# Altium schematic sheet HDMI8x8_HSSwitchSet.SchDoc
size 431 x 279 mm; Date: Not shown in title block; ApprovedBy: Not shown in title block; CheckedBy: Not shown in title block; Author: Not shown in title block; CompanyName: Not shown in title block; Engineer: Not shown in title block; Organization: Not shown in title block; Address1: Not shown in title block; Address2: Not shown in title block; Address3: Not shown in title block; Address4: Not shown in title block; DocumentNumber: 1; Revision: Use project parameter SCH_Rev; SheetNumber: 2; SheetTotal: 3; PageSetup: Record=PageOptions|CenterHorizontal=True|CenterVertical=True|PrintScale=1.00|XCorrection=1.00|YCorrection=1.00|PrintKind=0|BorderSize=5000000|LeftOffset=0|BottomOffset=0|Orientation=2|PaperLength=1000|PaperWidth=1000|Scale=100|PaperSource=15|PrintQuality=600|MediaType=1|DitherType=10|PaperKind=Letter|PrintScaleMode=1; CurrentTime: Not shown in title block; CurrentDate: Not shown in title block; Time: Not shown in title block; DocumentFullPathAndName: Not shown in title block; DocumentName: Not shown in title block; ModifiedDate: Not shown in title block; ImagePath: Not shown in title block
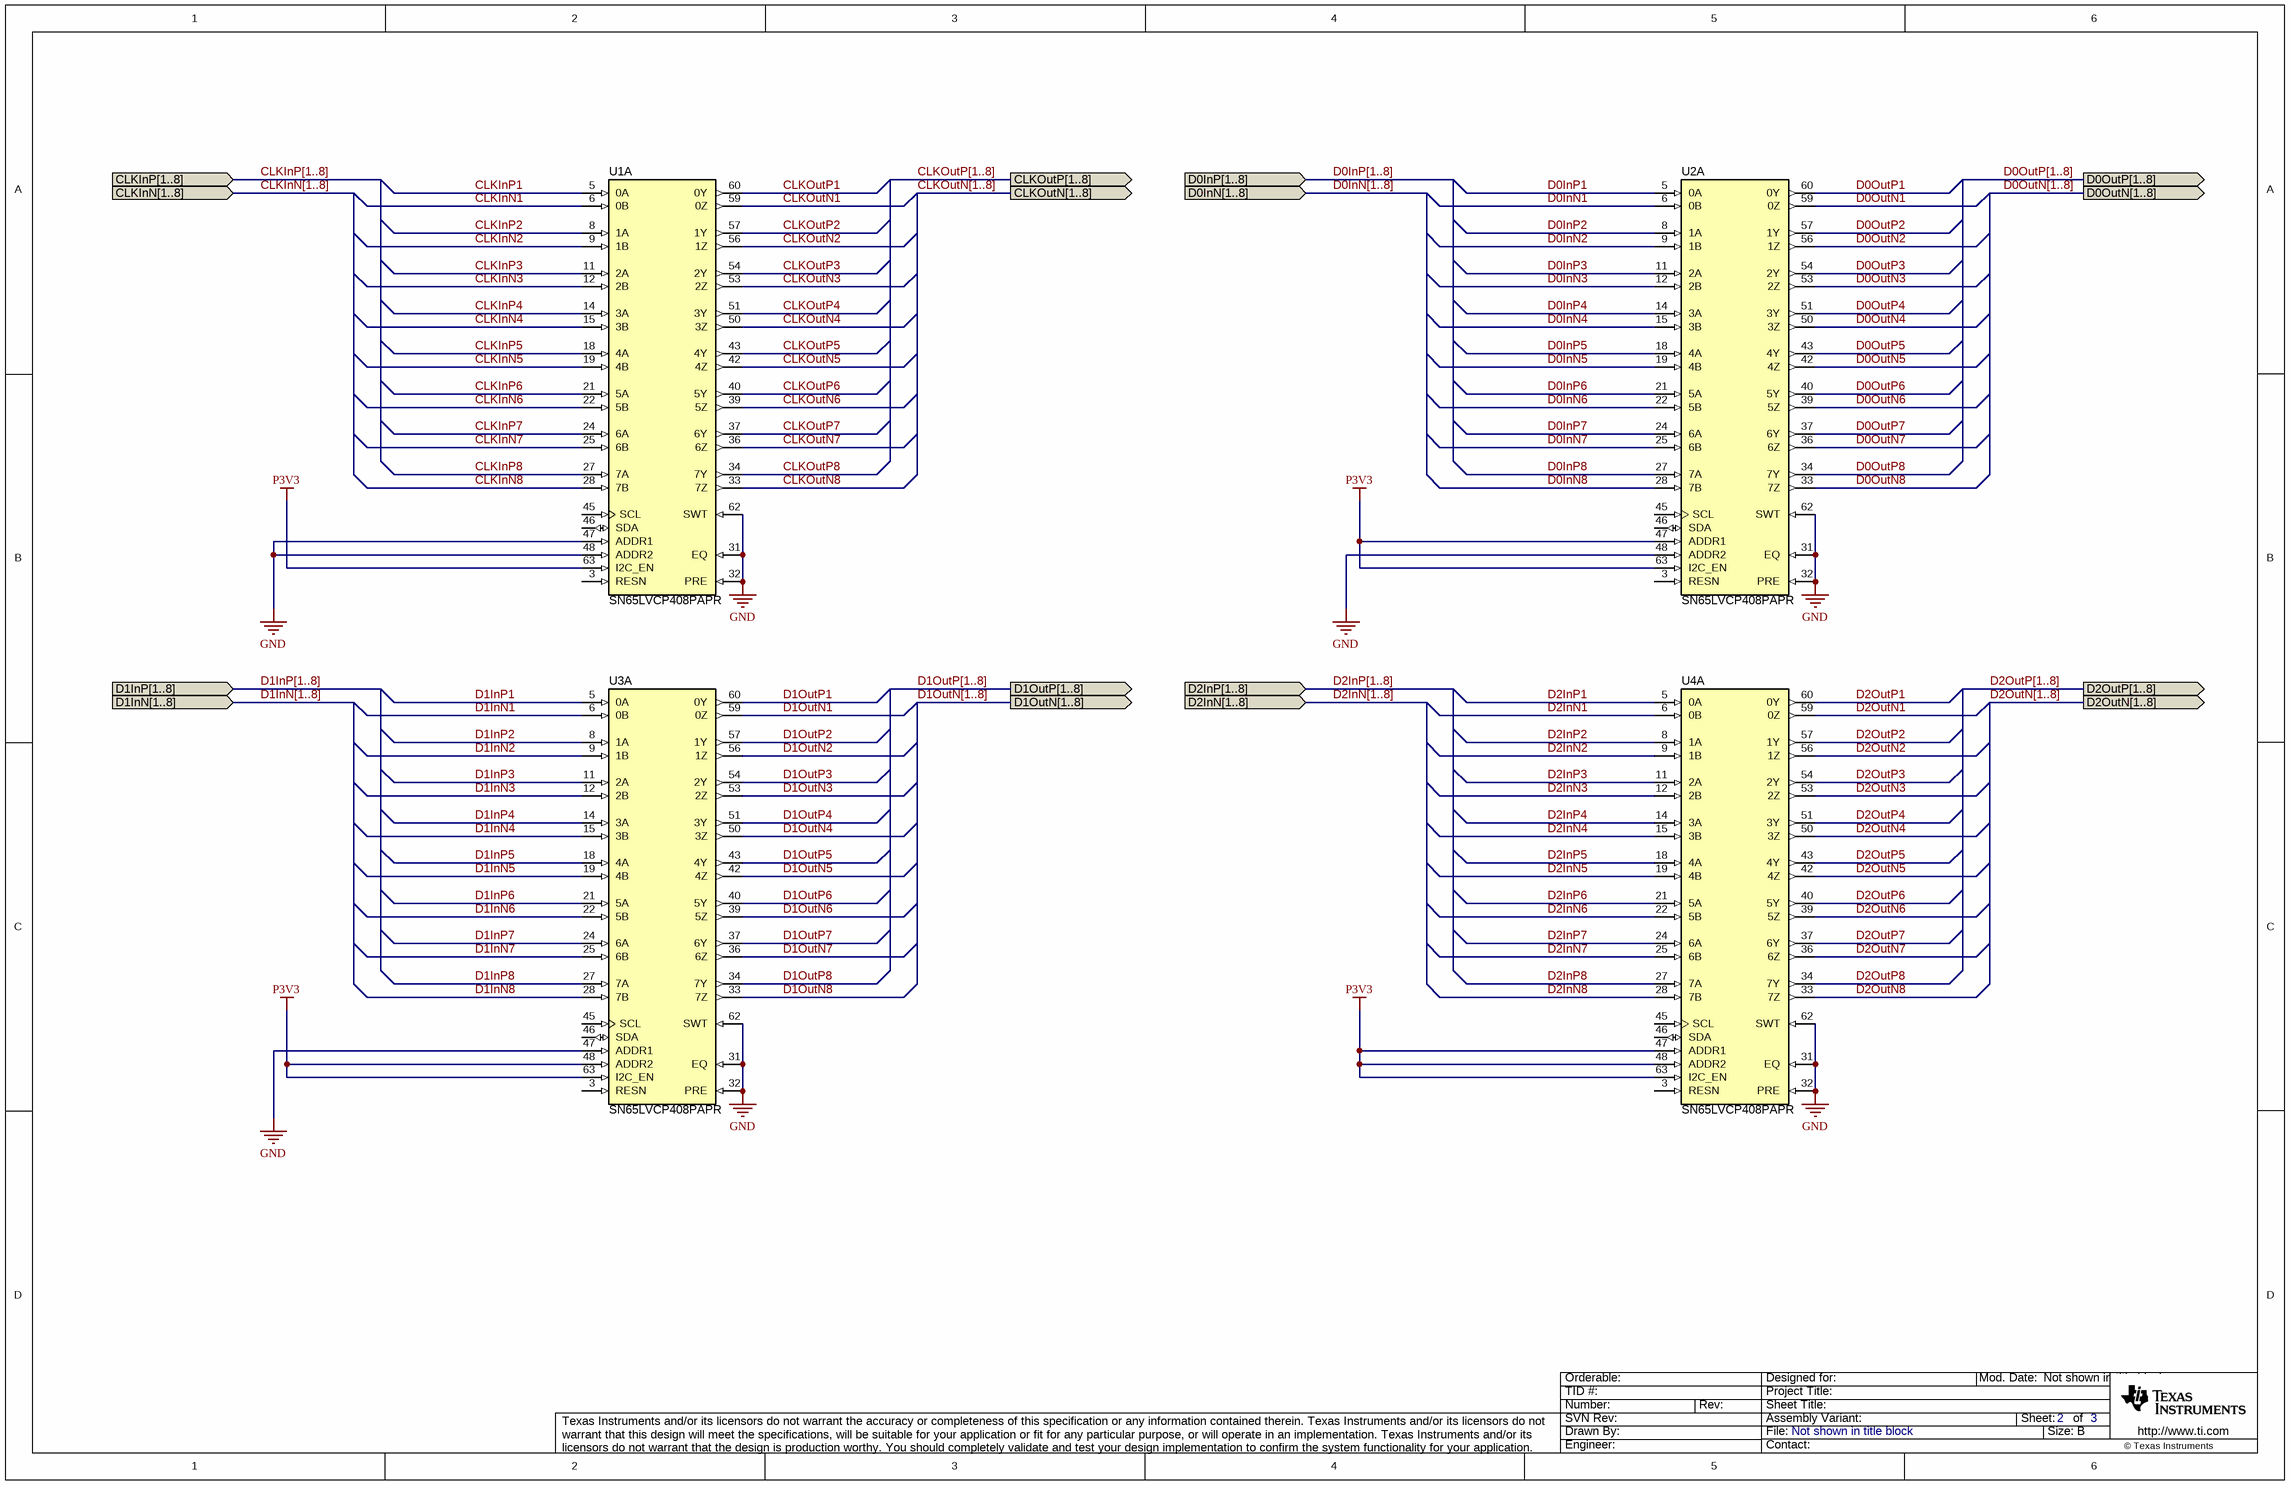
[diagram p0: HDMI8x8_HSSwitchSet.SchDoc]

## Parts
U1  SN65LVCP408PAPR  [PAP0064D_N]  (part A of 2)
U2  SN65LVCP408PAPR  [PAP0064D_N]  (part A of 2)
U3  SN65LVCP408PAPR  [PAP0064D_N]  (part A of 2)
U4  SN65LVCP408PAPR  [PAP0064D_N]  (part A of 2)

## Ports
CLKInN[1..8] (in), CLKInP[1..8] (in), CLKOutN[1..8] (out), CLKOutP[1..8] (out), D0InN[1..8] (in), D0InP[1..8] (in), D0OutN[1..8] (out), D0OutP[1..8] (out), D1InN[1..8] (in), D1InP[1..8] (in), D1OutN[1..8] (out), D1OutP[1..8] (out), D2InN[1..8] (in), D2InP[1..8] (in), D2OutN[1..8] (out), D2OutP[1..8] (out)

## Nets
GND: U1.31(EQ) U1.32(PRE) U1.47(ADDR1) U1.48(ADDR2) U1.62(SWT) U2.31(EQ) U2.32(PRE) U2.48(ADDR2) U2.62(SWT) U3.31(EQ) U3.32(PRE) U3.47(ADDR1) U3.62(SWT) U4.31(EQ) U4.32(PRE) U4.62(SWT)
P3V3: U1.63(I2C_EN) U2.47(ADDR1) U2.63(I2C_EN) U3.48(ADDR2) U3.63(I2C_EN) U4.47(ADDR1) U4.48(ADDR2) U4.63(I2C_EN)
CLKInN1: U1.6(0B)
CLKInN2: U1.9(1B)
CLKInN3: U1.12(2B)
CLKInN4: U1.15(3B)
CLKInN5: U1.19(4B)
CLKInN6: U1.22(5B)
CLKInN7: U1.25(6B)
CLKInN8: U1.28(7B)
CLKInP1: U1.5(0A)
CLKInP2: U1.8(1A)
CLKInP3: U1.11(2A)
CLKInP4: U1.14(3A)
CLKInP5: U1.18(4A)
CLKInP6: U1.21(5A)
CLKInP7: U1.24(6A)
CLKInP8: U1.27(7A)
CLKOutN1: U1.59(0Z)
CLKOutN2: U1.56(1Z)
CLKOutN3: U1.53(2Z)
CLKOutN4: U1.50(3Z)
CLKOutN5: U1.42(4Z)
CLKOutN6: U1.39(5Z)
CLKOutN7: U1.36(6Z)
CLKOutN8: U1.33(7Z)
CLKOutP1: U1.60(0Y)
CLKOutP2: U1.57(1Y)
CLKOutP3: U1.54(2Y)
CLKOutP4: U1.51(3Y)
CLKOutP5: U1.43(4Y)
CLKOutP6: U1.40(5Y)
CLKOutP7: U1.37(6Y)
CLKOutP8: U1.34(7Y)
D0InN1: U2.6(0B)
D0InN2: U2.9(1B)
D0InN3: U2.12(2B)
D0InN4: U2.15(3B)
D0InN5: U2.19(4B)
D0InN6: U2.22(5B)
D0InN7: U2.25(6B)
D0InN8: U2.28(7B)
D0InP1: U2.5(0A)
D0InP2: U2.8(1A)
D0InP3: U2.11(2A)
D0InP4: U2.14(3A)
D0InP5: U2.18(4A)
D0InP6: U2.21(5A)
D0InP7: U2.24(6A)
D0InP8: U2.27(7A)
D0OutN1: U2.59(0Z)
D0OutN2: U2.56(1Z)
D0OutN3: U2.53(2Z)
D0OutN4: U2.50(3Z)
D0OutN5: U2.42(4Z)
D0OutN6: U2.39(5Z)
D0OutN7: U2.36(6Z)
D0OutN8: U2.33(7Z)
D0OutP1: U2.60(0Y)
D0OutP2: U2.57(1Y)
D0OutP3: U2.54(2Y)
D0OutP4: U2.51(3Y)
D0OutP5: U2.43(4Y)
D0OutP6: U2.40(5Y)
D0OutP7: U2.37(6Y)
D0OutP8: U2.34(7Y)
D1InN1: U3.6(0B)
D1InN2: U3.9(1B)
D1InN3: U3.12(2B)
D1InN4: U3.15(3B)
D1InN5: U3.19(4B)
D1InN6: U3.22(5B)
D1InN7: U3.25(6B)
D1InN8: U3.28(7B)
D1InP1: U3.5(0A)
D1InP2: U3.8(1A)
D1InP3: U3.11(2A)
D1InP4: U3.14(3A)
D1InP5: U3.18(4A)
D1InP6: U3.21(5A)
D1InP7: U3.24(6A)
D1InP8: U3.27(7A)
D1OutN1: U3.59(0Z)
D1OutN2: U3.56(1Z)
D1OutN3: U3.53(2Z)
D1OutN4: U3.50(3Z)
D1OutN5: U3.42(4Z)
D1OutN6: U3.39(5Z)
D1OutN7: U3.36(6Z)
D1OutN8: U3.33(7Z)
D1OutP1: U3.60(0Y)
D1OutP2: U3.57(1Y)
D1OutP3: U3.54(2Y)
D1OutP4: U3.51(3Y)
D1OutP5: U3.43(4Y)
D1OutP6: U3.40(5Y)
D1OutP7: U3.37(6Y)
D1OutP8: U3.34(7Y)
D2InN1: U4.6(0B)
D2InN2: U4.9(1B)
D2InN3: U4.12(2B)
D2InN4: U4.15(3B)
D2InN5: U4.19(4B)
D2InN6: U4.22(5B)
D2InN7: U4.25(6B)
D2InN8: U4.28(7B)
D2InP1: U4.5(0A)
D2InP2: U4.8(1A)
D2InP3: U4.11(2A)
D2InP4: U4.14(3A)
D2InP5: U4.18(4A)
D2InP6: U4.21(5A)
D2InP7: U4.24(6A)
D2InP8: U4.27(7A)
D2OutN1: U4.59(0Z)
D2OutN2: U4.56(1Z)
D2OutN3: U4.53(2Z)
D2OutN4: U4.50(3Z)
D2OutN5: U4.42(4Z)
D2OutN6: U4.39(5Z)
D2OutN7: U4.36(6Z)
D2OutN8: U4.33(7Z)
D2OutP1: U4.60(0Y)
D2OutP2: U4.57(1Y)
D2OutP3: U4.54(2Y)
D2OutP4: U4.51(3Y)
D2OutP5: U4.43(4Y)
D2OutP6: U4.40(5Y)
D2OutP7: U4.37(6Y)
D2OutP8: U4.34(7Y)

Not connected (* = marked no-connect by the designer): U1 3(RESN) 45(SCL) 46(SDA); U2 3(RESN) 45(SCL) 46(SDA); U3 3(RESN) 45(SCL) 46(SDA); U4 3(RESN) 45(SCL) 46(SDA)

## Buses and harness runs
bus CLKInN[1..8] = port CLKInN[1..8]
bus CLKInP[1..8] = port CLKInP[1..8]
bus CLKOutN[1..8] = port CLKOutN[1..8]
bus CLKOutP[1..8] = port CLKOutP[1..8]
bus D0InN[1..8] = port D0InN[1..8]
bus D0InP[1..8] = port D0InP[1..8]
bus D0OutN[1..8] = port D0OutN[1..8]
bus D0OutP[1..8] = port D0OutP[1..8]
bus D1InN[1..8] = port D1InN[1..8]
bus D1InP[1..8] = port D1InP[1..8]
bus D1OutN[1..8] = port D1OutN[1..8]
bus D1OutP[1..8] = port D1OutP[1..8]
bus D2InN[1..8] = port D2InN[1..8]
bus D2InP[1..8] = port D2InP[1..8]
bus D2OutN[1..8] = port D2OutN[1..8]
bus D2OutP[1..8] = port D2OutP[1..8]

## Notes on the sheet
- Drawn By:
- SVN Rev:
- Number:
- TID #:
- Orderable:
- Rev:
- Sheet Title:
- File:
- Project Title:
- Designed for:
- Assembly Variant:
- Mod. Date:
- Sheet:
- Size:
- of
- B
- http://www.ti.com
- Texas Instruments and/or its licensors do not warrant the accuracy or completeness of this specification or any information contained therein. Texas Instruments and/or its licensors do not warrant that this design will meet the specifications, will be suitable for your application or fit for any particular purpose, or will operate in an implementation. Texas Instruments and/or its licensors do not warrant that the design is production worthy. You should completely validate and test your design implementation to confirm the system functionality for your application.
- Engineer:
- Contact:
- © Texas Instruments

## Library data of the parts
U1-U4 = SN65LVCP408PAPR: 8 x 8 4.25Gbps Crosspoint Swtich, 8 TX / 8 RX, 3.3V, -40 to 85 degC, 64-Pin HTQFP (PAP), Green (RoHS & no Sb/Br); Manufacturer: Texas Instruments; Alternate PartNumber: Equivalent; ICC(Max)(mA): 440; IN SigCon: EQ; OUT SigCon: Pre-E; ESD HBM(kV): 3; DatasheetVersion: SLLS842A; PackageVersion: revC, Aug-2003; PackageReference: PAP0064D; PackageDescription: 64-Pin Plastic Quad Flat Pack, 10 x 10 mm Body, 0.5 mm Pitch, Exposed Pad; Supplier 1: Digi-Key; Supplier Part Number 1: 296-25173-2-ND; Supplier 2: Digi-Key; Supplier Part Number 2: 296-25173-1-ND; Supplier 3: Digi-Key; Supplier Part Number 3: 296-25173-6-ND; Supplier 4: Newark; Supplier Part Number 4: 24R9948; Supplier 5: Mouser; Supplier Part Number 5: 595-SN65LVCP408PAPR; PartNumber: SN65LVCP408PAPR; MountType: SMT; Eco-Plan: Green (RoHS & no Sb/Br); Function: Crosspoint; Code_JEDEC: MS-026; ComponentLink1Description: Datasheet; ComponentLink1URL: http://www.ti.com/general/docs/lit/getliterature.tsp?genericPartNumber=SN65LVCP408&fileType=pdf; Alternate Manufacturer: Texas Instruments